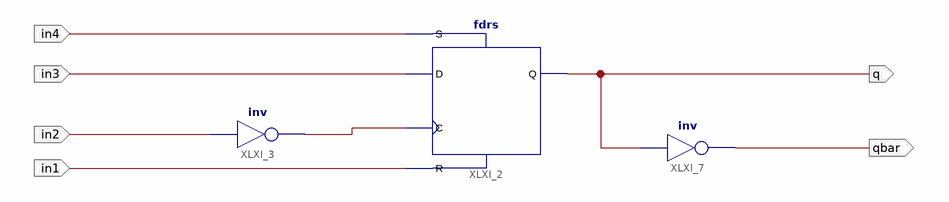
[diagram p0: schematic sheet 1]
// Xilinx ISE schematic mioc_flop_xilinx.sch (xc9500xl) as structural Verilog: 3 symbols, 6 ports
module mioc_flop_xilinx (
  input  in2,
  input  in3,
  input  in4,
  input  in1,
  output q,
  output qbar
);

  wire in2_n;

  fdrs XLXI_2 (.C(in2_n), .D(in3), .R(in1), .S(in4), .Q(q));
  not XLXI_3 (in2_n, in2);
  not XLXI_7 (qbar, q);
endmodule
